# Altium schematic sheet CPUBoard_p1.SchDoc
size A4
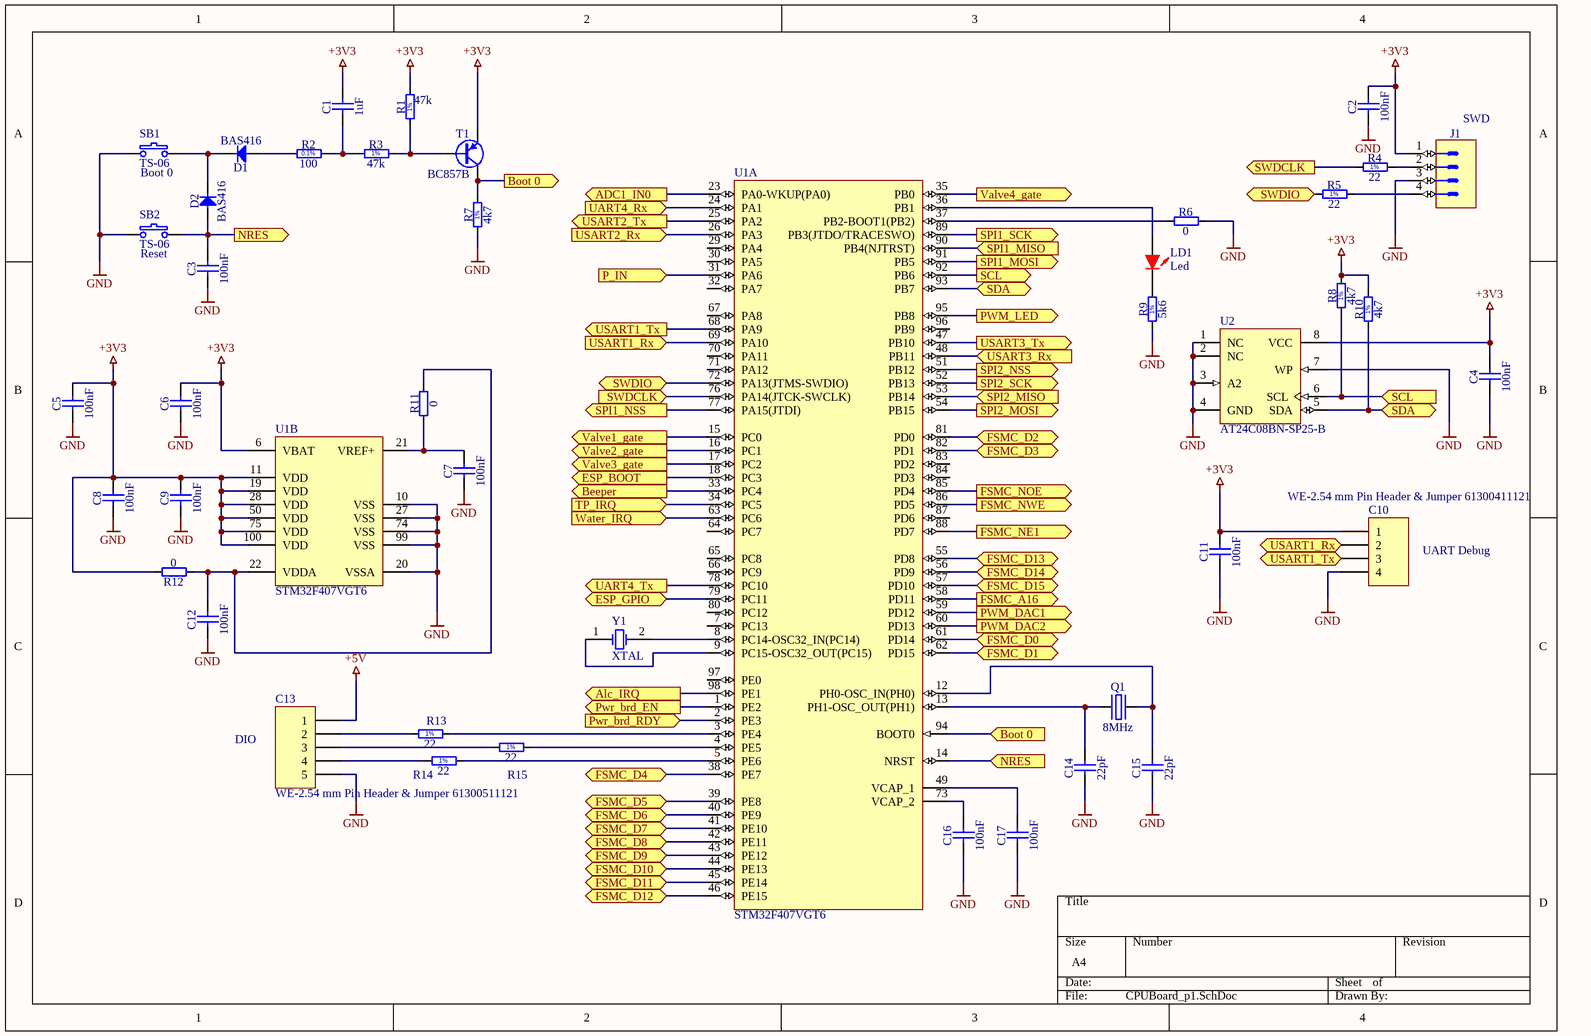
[diagram p0: CPUBoard_p1.SchDoc]

## Parts
C1  1uF  [CAPC2012X140N]
C2  100nF  [CAPC2012X135N]
C3  100nF  [CAPC2012X135N]
C4  100nF  [CAPC2012X135N]
C5  100nF  [CAPC2012X135N]
C6  100nF  [CAPC2012X135N]
C7  100nF  [CAPC2012X135N]
C8  100nF  [CAPC2012X135N]
C9  100nF  [CAPC2012X135N]
C10  WE-2.54 mm Pin Header & Jumper 61300411121  [61300411121]
C11  100nF  [CAPC2012X135N]
C12  100nF  [CAPC2012X135N]
C13  WE-2.54 mm Pin Header & Jumper 61300511121  [61300511121]
C14  22pF  [CAPC2012X135N]
C15  22pF  [CAPC2012X135N]
C16  100nF  [CAPC2012X135N]
C17  100nF  [CAPC2012X135N]
D1  BAS416  [SOD2512X110N]
D2  BAS416  [SOD2512X110N]
J1  KK®  [MOLEX_22-27-2041]  (value not drawn)
LD1  Led  [Led 0805-Red]
Q1  8MHz  [XTAL_HC-49/U-S]
R1  47k  [RESC2012X60N]
R2  100  [RESC2012X60N]
R3  47k  [RESC2012X60N]
R4  22  [RESC2012X60N]
R5  22  [RESC2012X60N]
R6  0  [RESC2012X60N]
R7  4k7  [RESC2012X60N]
R8  4k7  [RESC2012X60N]
R9  5k6  [RESC2012X60N]
R10  4k7  [RESC2012X60N]
R11  0  [RESC2012X60N]
R12  0  [RESC2012X60N]
R13  22  [RESC2012X60N]
R14  22  [RESC2012X60N]
R15  22  [RESC2012X60N]
SB1  TS-06  [TS-06]
SB2  TS-06  [TS-06]
T1  BC857B  [SOT95P230X110-3N]
U1  STM32F407VGT6  [STM-LQFP100_N]  (parts A,B of 2)
U2  AT24C08BN-SP25-B  [8S1_N]
Y1  XTAL  [R38]

## Ports
ADC1_IN0 (out), Alc_IRQ (out), Beeper (out), Boot 0 (in), Boot 0 (out), ESP_BOOT (out), ESP_GPIO (bidir), FSMC_A16 (out), FSMC_D0 (bidir), FSMC_D1 (bidir), FSMC_D2 (bidir), FSMC_D3 (bidir), FSMC_D4 (bidir), FSMC_D5 (bidir), FSMC_D6 (bidir), FSMC_D7 (bidir), FSMC_D8 (bidir), FSMC_D9 (bidir), FSMC_D10 (bidir), FSMC_D11 (bidir), FSMC_D12 (bidir), FSMC_D13 (bidir), FSMC_D14 (bidir), FSMC_D15 (bidir), FSMC_NE1 (out), FSMC_NOE (out), FSMC_NWE (out), NRES (in), NRES (out), P_IN (in), PWM_DAC1 (out), PWM_DAC2 (out), PWM_LED (out), Pwr_brd_EN (out), Pwr_brd_RDY (in), SCL (in), SCL (out), SDA (bidir), SPI1_MISO (in), SPI1_MOSI (out), SPI1_NSS (out), SPI1_SCK (out), SPI2_MISO (in), SPI2_MOSI (out), SPI2_NSS (out), SPI2_SCK (out), SWDCLK (in), SWDCLK (out), SWDIO (bidir), TP_IRQ (in), UART4_Rx (in), UART4_Tx (out), USART1_Rx (in), USART1_Rx (out), USART1_Tx (in), USART1_Tx (out), USART2_Rx (in), USART2_Tx (out), USART3_Rx (in), USART3_Tx (out), Valve1_gate (out), Valve2_gate (out), Valve3_gate (out), Valve4_gate (out), Water_IRQ (in)

## Nets
+3V3: C1.2 C2.2 C4.2 C5.2 C6.2 C8.2 C9.2 C10.1 C11.2 J1.1 R1.2 R8.2 R10.2 R12.2 T1.2(E) U1.6(VBAT) U1.11(VDD) U1.19(VDD) U1.28(VDD) U1.50(VDD) U1.75(VDD) U1.100(VDD) U2.8(VCC)
+5V: C13.1
GND: C2.1 C3.1 C4.1 C5.1 C6.1 C7.1 C8.1 C9.1 C10.4 C11.1 C12.1 C13.5 C14.1 C15.1 C16.1 C17.1 J1.3 R6.2 R7.1 R9.1 SB1.1 SB2.1 U1.10(VSS) U1.20(VSSA) U1.27(VSS) U1.74(VSS) U1.99(VSS) U2.1(NC) U2.2(NC) U2.3(A2) U2.4(GND) U2.7(WP)
ADC1_IN0: U1.23(PA0-WKUP(PA0)) ; port ADC1_IN0
Alc_IRQ: U1.98(PE1) ; port Alc_IRQ
Beeper: U1.33(PC4) ; port Beeper
Boot 0: R7.2 T1.3(C) U1.94(BOOT0) ; port Boot 0
ESP_BOOT: U1.18(PC3) ; port ESP_BOOT
ESP_GPIO: U1.79(PC11) ; port ESP_GPIO
FSMC_A16: U1.58(PD11) ; port FSMC_A16
FSMC_D0: U1.61(PD14) ; port FSMC_D0
FSMC_D1: U1.62(PD15) ; port FSMC_D1
FSMC_D2: U1.81(PD0) ; port FSMC_D2
FSMC_D3: U1.82(PD1) ; port FSMC_D3
FSMC_D4: U1.38(PE7) ; port FSMC_D4
FSMC_D5: U1.39(PE8) ; port FSMC_D5
FSMC_D6: U1.40(PE9) ; port FSMC_D6
FSMC_D7: U1.41(PE10) ; port FSMC_D7
FSMC_D8: U1.42(PE11) ; port FSMC_D8
FSMC_D9: U1.43(PE12) ; port FSMC_D9
FSMC_D10: U1.44(PE13) ; port FSMC_D10
FSMC_D11: U1.45(PE14) ; port FSMC_D11
FSMC_D12: U1.46(PE15) ; port FSMC_D12
FSMC_D13: U1.55(PD8) ; port FSMC_D13
FSMC_D14: U1.56(PD9) ; port FSMC_D14
FSMC_D15: U1.57(PD10) ; port FSMC_D15
FSMC_NE1: U1.88(PD7) ; port FSMC_NE1
FSMC_NOE: U1.85(PD4) ; port FSMC_NOE
FSMC_NWE: U1.86(PD5) ; port FSMC_NWE
NRES: C3.2 D2.2(A) SB2.2 U1.14(NRST) ; port NRES
P_IN: U1.31(PA6) ; port P_IN
PWM_DAC1: U1.59(PD12) ; port PWM_DAC1
PWM_DAC2: U1.60(PD13) ; port PWM_DAC2
PWM_LED: U1.95(PB8) ; port PWM_LED
Pwr_brd_EN: U1.1(PE2) ; port Pwr_brd_EN
Pwr_brd_RDY: U1.2(PE3) ; port Pwr_brd_RDY
SCL: R8.1 U1.92(PB6) U2.6(SCL) ; port SCL
SDA: R10.1 U1.93(PB7) U2.5(SDA) ; port SDA
SPI1_MISO: U1.90(PB4(NJTRST)) ; port SPI1_MISO
SPI1_MOSI: U1.91(PB5) ; port SPI1_MOSI
SPI1_NSS: U1.77(PA15(JTDI)) ; port SPI1_NSS
SPI1_SCK: U1.89(PB3(JTDO/TRACESWO)) ; port SPI1_SCK
SPI2_MISO: U1.53(PB14) ; port SPI2_MISO
SPI2_MOSI: U1.54(PB15) ; port SPI2_MOSI
SPI2_NSS: U1.51(PB12) ; port SPI2_NSS
SPI2_SCK: U1.52(PB13) ; port SPI2_SCK
SWDCLK: R4.1 U1.76(PA14(JTCK-SWCLK)) ; port SWDCLK
SWDIO: R5.1 U1.72(PA13(JTMS-SWDIO)) ; port SWDIO
TP_IRQ: U1.34(PC5) ; port TP_IRQ
UART4_Rx: U1.24(PA1) ; port UART4_Rx
UART4_Tx: U1.78(PC10) ; port UART4_Tx
USART1_Rx: C10.2 U1.69(PA10) ; port USART1_Rx
USART1_Tx: C10.3 U1.68(PA9) ; port USART1_Tx
USART2_Rx: U1.26(PA3) ; port USART2_Rx
USART2_Tx: U1.25(PA2) ; port USART2_Tx
USART3_Rx: U1.48(PB11) ; port USART3_Rx
USART3_Tx: U1.47(PB10) ; port USART3_Tx
Valve1_gate: U1.15(PC0) ; port Valve1_gate
Valve2_gate: U1.16(PC1) ; port Valve2_gate
Valve3_gate: U1.17(PC2) ; port Valve3_gate
Valve4_gate: U1.35(PB0) ; port Valve4_gate
Water_IRQ: U1.63(PC6) ; port Water_IRQ
NetC1_1: C1.1 R2.2 R3.1
NetC7_2: C7.2 R11.1 U1.21(VREF+)
NetC12_2: C12.2 R11.2 R12.1 U1.22(VDDA)
NetC13_2: C13.2 R13.1
NetC13_3: C13.3 R15.1
NetC13_4: C13.4 R14.1
NetC14_2: C14.2 Q1.1(OSC1) U1.13(PH1-OSC_OUT(PH1))
NetC15_2: C15.2 Q1.2(OSC2) U1.12(PH0-OSC_IN(PH0))
NetC16_2: C16.2 U1.73(VCAP_2)
NetC17_2: C17.2 U1.49(VCAP_1)
NetD1_1: D1.1(C) D2.1(C) SB1.2
NetD1_2: D1.2(A) R2.1
NetJ1_2: J1.2 R4.2
NetJ1_4: J1.4 R5.2
NetLD1_1: LD1.1(A) U1.36(PB1)
NetLD1_2: LD1.2(K) R9.2
NetR1_1: R1.1 R3.2 T1.1(B)
NetR6_1: R6.1 U1.37(PB2-BOOT1(PB2))
NetR13_2: R13.2 U1.3(PE4)
NetR14_2: R14.2 U1.5(PE6)
NetR15_2: R15.2 U1.4(PE5)
NetU1_8: U1.8(PC14-OSC32_IN(PC14)) Y1.2(OSC2)
NetU1_9: U1.9(PC15-OSC32_OUT(PC15)) Y1.1(OSC1)

Not connected (* = marked no-connect by the designer): U1 7(PC13) 29(PA4) 30(PA5) 32(PA7) 64(PC7) 65(PC8) 66(PC9) 67(PA8) 70(PA11) 71(PA12) 80(PC12) 83(PD2) 84(PD3) 87(PD6) 96(PB9) 97(PE0)

## Notes on the sheet
- (near SB1) Boot 0
- (near J1) SWD
- (near SB2) Reset
- UART Debug
- DIO
- (in symbol R0805_4K7_1%_0.125W_100PPM) 1%
- (in symbol R0805_5K6_1%_0.125W_100PPM) 1%
- (in symbol R0805_22R_1%_0.125W_100PPM) 1%
- (in symbol R0805_47K_1%_0.125W_100PPM) 1%
- (in symbol R0805_100R_0.1%_0.1W_10PPM) 0.1%

## Library data of the parts
C1 = CC0805_1UF_35V_20%_X7R: Non-polarised capacitor; Part Description: SMD Multilayer Chip Ceramic Capacitor; Manufacturer: GENERIC; Manufacturer1 Part Number: GMK212B7105MG-T; Voltage: 35V; TC: X7R; Tolerance: ±20%; Table: Capacitors SMD; Part Number: CC0805_1UF_35V_20%_X7R; Component Kind: Standard; Component Type: Standard; Pin Count: 2; Value: 1uF; Status: Not Recommended; Manufacturer Part Number: CC0805_1UF_35V_20%_X7R; Case: 0805; Mounted: Yes; Socket: No; SMD: Yes; Manufacturer1 Example: TAIYO YUDEN; Manufacturer1 ComponentHeight: 1.35mm; HelpURL: \\cern.ch\dfs\Applications\Altium\Datasheets\CC0805_X7R_TAIYO-YUDEN_HIGH-VALUE.pdf; Author: CERN DEM JLC; CreateDate: 22.06.2011; LatestRevisionDate: 22.06.2011
C2-C9 C11 C12 C16 C17 = CC0805_100NF_50V_10%_X7R: Non-polarised capacitor; Part Description: SMD Multilayer Chip Ceramic Capacitor; Manufacturer: GENERIC; Manufacturer1 Part Number: B37941K5104K62; Voltage: 50V; TC: X7R; Tolerance: ±10%; Table: Capacitors SMD; Part Number: CC0805_100NF_50V_10%_X7R; Component Kind: Standard; Component Type: Standard; Pin Count: 2; Value: 100nF; Status: Preferred; Manufacturer Part Number: CC0805_100NF_50V_10%_X7R; Case: 0805; Mounted: Yes; Socket: No; SMD: Yes; Manufacturer1 Example: EPCOS; Manufacturer1 ComponentHeight: 1.35mm; HelpURL: \\cern.ch\dfs\Applications\Altium\Datasheets\CC0805_X7R_EPCOS.pdf; Author: CERN DEM JLC; CreateDate: 03.12.2007; LatestRevisionDate: 03.12.2007
C10 = WE-2.54 mm Pin Header & Jumper 61300411121: WR-PHD 2.54mm Pin Header; Manufacturer: WЁ№rth Elektronik eiSos GmbH; ComponentLink1 Description: Manufacturer; ComponentLink2 Description: Datasheet; NoPins: 04; Created Date: 22 March 2013; partNo: 61300411121; ComponentLink1URL: http://www.we-online.com; ComponentLink2URL: http://katalog.we-online.de/em/datasheet/6130xx11121.pdf; Created by: Karrer Zheng
C13 = WE-2.54 mm Pin Header & Jumper 61300511121: WR-PHD 2.54mm Pin Header; Manufacturer: WЁ№rth Elektronik eiSos GmbH; ComponentLink1 Description: Manufacturer; ComponentLink2 Description: Datasheet; NoPins: 05; Created Date: 22 March 2013; partNo: 61300511121; ComponentLink1URL: http://www.we-online.com; ComponentLink2URL: http://katalog.we-online.de/em/datasheet/6130xx11121.pdf; Created by: Karrer Zheng
C14 C15 = CC0805_22PF_50V_5%_NP0: Non-polarised capacitor; Part Description: SMD Multilayer Chip Ceramic Capacitor; Manufacturer: GENERIC; Manufacturer1 Part Number: 223886115229; Voltage: 50V; TC: NP0; Tolerance: ±5%; Table: Capacitors SMD; Part Number: CC0805_22PF_50V_5%_NP0; Component Kind: Standard; Component Type: Standard; Pin Count: 2; Value: 22pF; Status: Preferred; Manufacturer Part Number: CC0805_22PF_50V_5%_NP0; Case: 0805; Mounted: Yes; Socket: No; SMD: Yes; Manufacturer1 Example: PHYCOMP; Manufacturer1 ComponentHeight: 1.35mm; HelpURL: \\cern.ch\dfs\Applications\Altium\Datasheets\CC0805_NP0_PHYCOMP.pdf; Author: CERN DEM JLC; CreateDate: 03.12.2007; LatestRevisionDate: 03.12.2007
D1 D2 = BAS416: Diode; Part Description: Low-Leakage Diode; Manufacturer: NXP SEMICONDUCTORS; Voltage: 75V; Power: 200mA; Table: Diodes; Part Number: BAS416; Component Kind: Standard; Component Type: Standard; Device: BAS416; PackageDescription: Small Outline Diode Flat Lead (SOD-323), 1.70mm W X 1.25mm L X 1.10mm H body,  IPC Medium Density; Manufacturer Part Number: BAS416; Pin Count: 2; Case: SOD323; Mounted: Yes; Socket: No; SMD: Yes; ComponentHeight: 1.1mm; HelpURL: \\cern.ch\dfs\Applications\Altium\Datasheets\BAS416.pdf; Author: CERN DEM JLC; CreateDate: 01.10.2013; LatestRevisionDate: 01.10.2013
J1 = MOLEX_22-27-2041: Connector 4 Male; Part Description: 2.54mm (.100") Pitch KK® Wire-to-Board Header, Vertical, with Friction Lock, 4 Circuits, Tin (Sn) Plating; Manufacturer: MOLEX; Part Number: MOLEX_22-27-2041; Component Kind: Standard; Component Type: Standard; Pin Count: 4; Family: KK®; Mounted: Yes; Socket: No; SMD: No; Status: None; Manufacturer Part Number: 22-27-2041; ComponentHeight: 11.7mm; HelpURL: \\cern.ch\dfs\Applications\Altium\Datasheets\MOLEX_22-27-2041.pdf; Author: CERN DEM JLC; CreateDate: 04.12.2008; LatestRevisionDate: 04.12.2008; Table: MOLEX
LD1 = Led 0805 KP-2012EC: Red  627nm 12mcd; Price: 0.09
Q1 = XTAL_5MHZ_CITIZEN_HC49US5.000MABJ-UB: Quartz Crystal; Part Description: Tolerance:± 30ppm, Stability:± 50ppm, -10°C to +60°C, 18pF, Quartz Crystal, HC-49/U-S Serie; Manufacturer: CITIZEN FINETECH MIYOTA CO; Table: Crystals & Oscillators; Part Number: XTAL_5MHZ_CITIZEN_HC49US5.000MABJ-UB; Component Kind: Standard; Component Type: Standard; PackageDescription: HC-49/U-S Leaded Cristal, Body 11.5x4.66mm; Pitch 4.88mm; Value: 8MHz; Manufacturer Part Number: HC49US5.000MABJ-UB; Pin Count: 2; Mounted: Yes; Socket: No; SMD: No; ComponentHeight: 3.5mm; HelpURL: \\cern.ch\dfs\Applications\Altium\Datasheets\XTAL_CITIZEN_HC-49-U-S.pdf; Author: CERN DEM JLC; CreateDate: 27.11.2012; LatestRevisionDate: 27.11.2012
R1 R3 = R0805_47K_1%_0.125W_100PPM: Resistor - 1%; Part Description: General Purpose Thick Film Chip Resistor; Manufacturer: GENERIC; Manufacturer1 Part Number: NRC10F4702TRF; Power: 0.125W; TC: ±100ppm/°C; Table: Resistors SMD; Part Number: R0805_47K_1%_0.125W_100PPM; Component Kind: Standard; Component Type: Standard; Pin Count: 2; Value: 47k; Status: Preferred; Tolerance: ±1%; Manufacturer Part Number: R0805_47K_1%_0.125W_100PPM; Case: 0805; Mounted: Yes; Socket: No; SMD: Yes; Manufacturer1 Example: NIC COMPONENT; Manufacturer1 ComponentHeight: 0.6mm; HelpURL: \\cern.ch\dfs\Applications\Altium\Datasheets\R0805_NIC_NRC.pdf; Author: CERN DEM JLC; CreateDate: 03.12.2007; LatestRevisionDate: 13.03.2008
R2 = R0805_100R_0.1%_0.1W_10PPM: Resistor - 0.1%; Part Description: Thin Film Chip Resistor; Manufacturer: GENERIC; Manufacturer1 Part Number: RN73C2A100RBTG; Power: 0.1W; TC: ±10ppm; Table: Resistors SMD; Part Number: R0805_100R_0.1%_0.1W_10PPM; Component Kind: Standard; Component Type: Standard; Pin Count: 2; Value: 100; Status: Not recommended; Tolerance: ±0.1%; Manufacturer Part Number: R0805_100R_0.1%_0.1W_10PPM; Case: 0805; Mounted: Yes; Socket: No; SMD: Yes; Manufacturer1 Example: TYCO HOLSWORTHY; Manufacturer1 ComponentHeight: 0.6mm; HelpURL: \\cern.ch\dfs\Applications\Altium\Datasheets\R0805_Tyco_RN73.pdf; Author: CERN DEM JLC; CreateDate: 03.12.2007; LatestRevisionDate: 13.03.2008
R4 R5 R13-R15 = R0805_22R_1%_0.125W_100PPM: Resistor - 1%; Part Description: General Purpose Thick Film Chip Resistor; Manufacturer: GENERIC; Manufacturer1 Part Number: NRC10F22R0TRF; Power: 0.125W; TC: ±100ppm/°C; Table: Resistors SMD; Part Number: R0805_22R_1%_0.125W_100PPM; Component Kind: Standard; Component Type: Standard; Pin Count: 2; Value: 22; Status: Preferred; Tolerance: ±1%; Manufacturer Part Number: R0805_22R_1%_0.125W_100PPM; Case: 0805; Mounted: Yes; Socket: No; SMD: Yes; Manufacturer1 Example: NIC COMPONENT; Manufacturer1 ComponentHeight: 0.6mm; HelpURL: \\cern.ch\dfs\Applications\Altium\Datasheets\R0805_NIC_NRC.pdf; Author: CERN DEM JLC; CreateDate: 03.12.2007; LatestRevisionDate: 13.03.2008
R6 R11 R12 = R0805_0R_JUMPER: Resistor; Part Description: 2A (0.05R Max DC Resistance) Zero Ohm Jumper; Manufacturer: GENERIC; Manufacturer1 Part Number: NRC10Z0; Table: Resistors SMD; Part Number: R0805_0R_JUMPER; Component Kind: Standard; Component Type: Standard; Pin Count: 2; Value: 0; Status: Preferred; Manufacturer Part Number: R0805_0R_JUMPER; Case: 0805; Mounted: Yes; Socket: No; SMD: Yes; Manufacturer1 Example: NIC COMPONENT; Manufacturer1 ComponentHeight: 0.6mm; HelpURL: \\cern.ch\dfs\Applications\Altium\Datasheets\R0805_NIC_NRC.pdf; Author: CERN DEM JLC; CreateDate: 03.12.2007; LatestRevisionDate: 13.03.2008
R7 R8 R10 = R0805_4K7_1%_0.125W_100PPM: Resistor - 1%; Part Description: General Purpose Thick Film Chip Resistor; Manufacturer: GENERIC; Manufacturer1 Part Number: NRC10F4701TRF; Power: 0.125W; TC: ±100ppm/°C; Table: Resistors SMD; Part Number: R0805_4K7_1%_0.125W_100PPM; Component Kind: Standard; Component Type: Standard; Pin Count: 2; Value: 4k7; Status: Preferred; Tolerance: ±1%; Manufacturer Part Number: R0805_4K7_1%_0.125W_100PPM; Case: 0805; Mounted: Yes; Socket: No; SMD: Yes; Manufacturer1 Example: NIC COMPONENT; Manufacturer1 ComponentHeight: 0.6mm; HelpURL: \\cern.ch\dfs\Applications\Altium\Datasheets\R0805_NIC_NRC.pdf; Author: CERN DEM JLC; CreateDate: 03.12.2007; LatestRevisionDate: 13.03.2008
R9 = R0805_5K6_1%_0.125W_100PPM: Resistor - 1%; Part Description: General Purpose Thick Film Chip Resistor; Manufacturer: GENERIC; Manufacturer1 Part Number: NRC10F5601TRF; Power: 0.125W; TC: ±100ppm/°C; Table: Resistors SMD; Part Number: R0805_5K6_1%_0.125W_100PPM; Component Kind: Standard; Component Type: Standard; Pin Count: 2; Value: 5k6; Status: Preferred; Tolerance: ±1%; Manufacturer Part Number: R0805_5K6_1%_0.125W_100PPM; Case: 0805; Mounted: Yes; Socket: No; SMD: Yes; Manufacturer1 Example: NIC COMPONENT; Manufacturer1 ComponentHeight: 0.6mm; HelpURL: \\cern.ch\dfs\Applications\Altium\Datasheets\R0805_NIC_NRC.pdf; Author: CERN DEM JLC; CreateDate: 03.12.2007; LatestRevisionDate: 13.03.2008
SB1 SB2 = Buton TS-06: Price: 0.15
T1 = BC857B: PNP Transistor; Part Description: 45V 100mA PNP general-purpose transistors; Manufacturer: NXP SEMICONDUCTORS; Table: Transistors; Part Number: BC857B; Component Kind: Standard; Component Type: Standard; Device: BC857B; PackageDescription: SOT23, 3 pin, Pitch 0.95mm - 1.3mm W X 2.9mm L X 1.1mm H, IPC Medium Density; Manufacturer Part Number: BC857B; Pin Count: 3; Case: SOT23-3; Mounted: Yes; Socket: No; SMD: Yes; ComponentHeight: 1.1mm; HelpURL: \\cern.ch\dfs\Applications\Altium\Datasheets\BC857B.pdf; Author: CERN DEM JLC; CreateDate: 14.06.2011; LatestRevisionDate: 14.06.2011
U1 = STM32F407VGT6: ARM Cortex-M4 32-bit MCU+FPU, 210 DMIPS, 1024 kB Flash, 192 kB Internal RAM, 82 I/Os, 100-pin LQFP, -40 to 85 degC, Tray; Manufacturer: STMicroelectronics; D/A Converter: 2x12-bit; FLASH Size (Prog) (kB): 1024; I/Os (High Current): 82; Internal RAM Size (kB): 192; Operating Frequency(F) (Processor speed) (MHz): 168; Supply Voltage(Vcc) max (V): 3.6; Supply Voltage(Vcc) min (V): 1.8; DatasheetVersion: Rev. 4; PackageVersion: Rev. 1, 06/2013; PackageReference: LQFP100; PackageDescription: 100-Pin Low Profile Quad Flat Package, 14 x 14 mm Body, 0.5 mm Pitch; Supplier 1: Digi-Key; Supplier Part Number 1: 497-11605-ND; Supplier 2: Farnell; Supplier Part Number 2: 2064368; Supplier 3: Newark; Supplier Part Number 3: 73T2333; Supplier 4: Mouser; Supplier Part Number 4: 511-STM32F407VGT6; Core: ARM Cortex-M4; Packing: Tray; Mounting Technology: Surface Mount; PartNumber: STM32F407VGT6; ComponentLink1Description: Manufacturer URL; ComponentLink1URL: http://www.st.com/web/en/home.html; ComponentLink2Description: Datasheet; ComponentLink2URL: http://www.st.com/st-web-ui/static/active/en/resource/technical/document/datasheet/DM00037051.pdf; ComponentLink3Description: Package Specification; ComponentLink3URL: http://www.st.com/st-web-ui/static/active/en/resource/technical/document/data_brief/DM00071938.pdf
U2 = AT24C08BN-SP25-B: 8Kbit (1024 x 8), 2-wire Bus Automotive Serial EEPROM with Write Protect, 2.5V, 8-Pin SOIC, Bulk; DatasheetVersion: 8517C,  Jan-2009; PackageVersion: revC, Mar-2005; PackageReference: 8S1; PackageDescription: 8-Lead (0.150" Wide Body), Plastic Gull Wing Small Outline (JEDEC SOIC); Code_JEDEC: MS-012-AA; Code_IPC: SOIC127P600-8; ComponentLink1Description: Manufacturer URL; ComponentLink1URL: http://www.atmel.com/; ComponentLink2Description: Datasheet; ComponentLink2URL: http://www.atmel.com/dyn/resources/prod_documents/doc8517.pdf
Y1 = XTAL: Crystal Oscillator; Published: 8-Jun-2000; LatestRevisionDate: 17-Jul-2002; LatestRevisionNote: Re-released for DXP Platform.; PackageReference: R38; Publisher: Altium Limited; PackageDescription: Crystal, Thru-Hole; 2 Leads; Body 3.1 x 8.2 mm (Dia.xH)